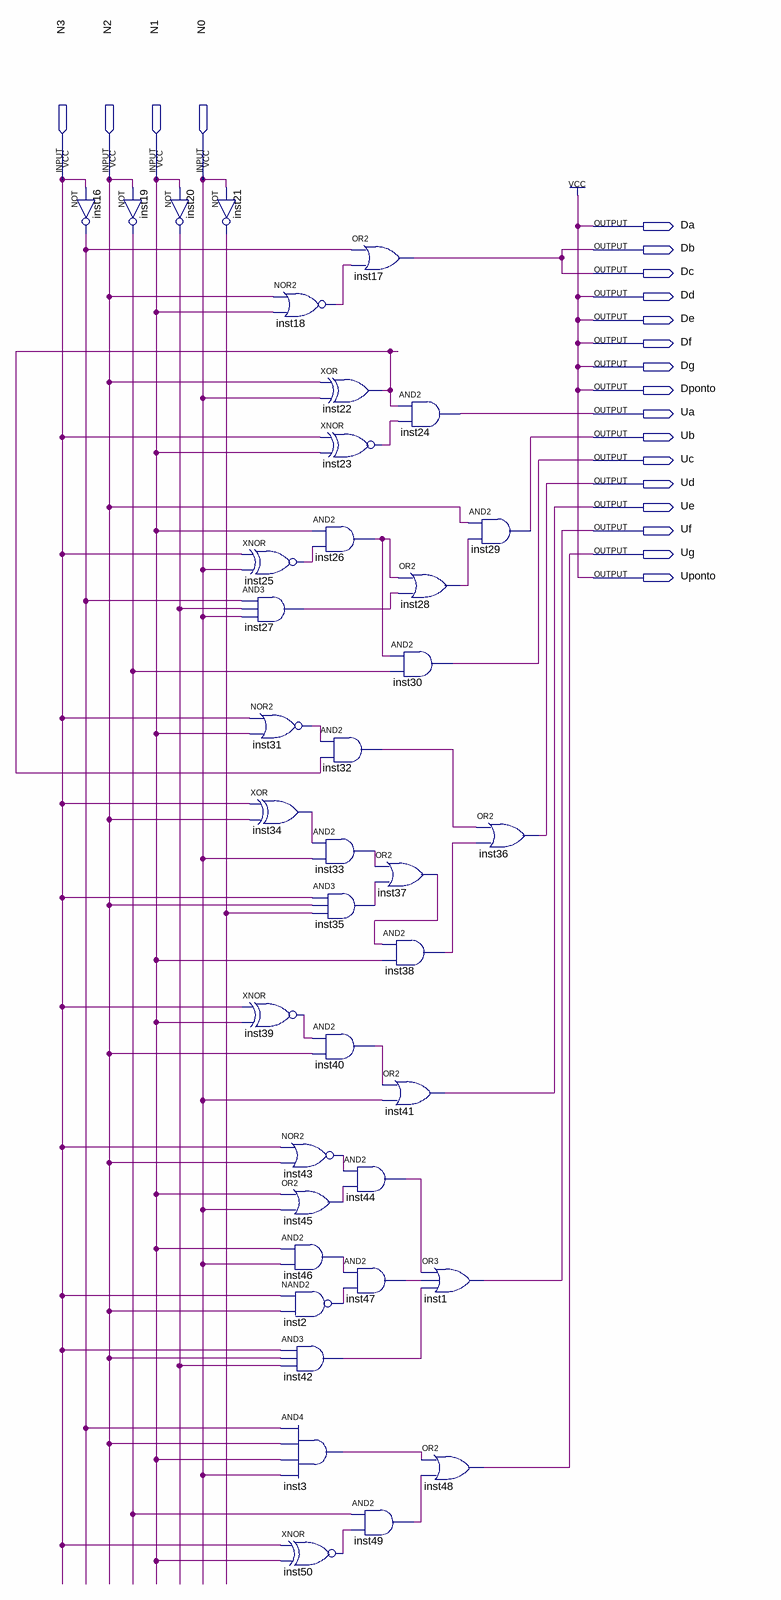
[diagram p0: schematic sheet]
// Quartus schematic decoder-7-seg-2-dig.bdf as structural Verilog: 38 symbols, 20 pins
module \decoder-7-seg-2-dig  (
  input  N3,
  input  N2,
  input  N1,
  input  N0,
  output Da,
  output Db,
  output Dc,
  output Dd,
  output De,
  output Df,
  output Dg,
  output Dponto,
  output Ua,
  output Ub,
  output Uc,
  output Ud,
  output Ue,
  output Uf,
  output Ug,
  output Uponto
);

  wire inst2_out, inst3_out, inst16_out, inst18_out, inst19_out, inst20_out, inst21_out, inst22_out,
       inst23_out, inst25_out, inst26_out, inst27_out, inst28_out, inst31_out, inst32_out, inst33_out,
       inst34_out, inst35_out, inst37_out, inst38_out, inst39_out, inst40_out, inst42_out, inst43_out,
       inst44_out, inst45_out, inst46_out, inst47_out, inst49_out, inst50_out;

  not inst16 (inst16_out, N3);
  not inst19 (inst19_out, N2);
  not inst20 (inst20_out, N1);
  not inst21 (inst21_out, N0);
  xnor inst25 (inst25_out, N3, N0);
  and inst27 (inst27_out, inst16_out, inst20_out, N0);
  nor inst31 (inst31_out, N3, N1);
  xor inst34 (inst34_out, N3, N2);
  xnor inst39 (inst39_out, N3, N1);
  nor inst18 (inst18_out, N2, N1);
  xor inst22 (inst22_out, N2, N0);
  xnor inst23 (inst23_out, N3, N1);
  and inst26 (inst26_out, N1, inst25_out);
  and inst32 (inst32_out, inst31_out, inst22_out);
  and inst33 (inst33_out, inst34_out, N0);
  and inst35 (inst35_out, N3, N2, inst21_out);
  and inst40 (inst40_out, inst39_out, N2);
  nor inst43 (inst43_out, N3, N2);
  or inst45 (inst45_out, N1, N0);
  and inst46 (inst46_out, N1, N0);
  nand inst2 (inst2_out, N3, N2);
  and inst42 (inst42_out, N3, N2, inst20_out);
  and inst3 (inst3_out, inst16_out, N2, N1, N0);
  xnor inst50 (inst50_out, N3, N1);
  or inst17 (Db, inst16_out, inst18_out);
  or inst37 (inst37_out, inst33_out, inst35_out);
  and inst38 (inst38_out, inst37_out, N1);
  or inst41 (Ue, inst40_out, N0);
  and inst44 (inst44_out, inst43_out, inst45_out);
  and inst47 (inst47_out, inst46_out, inst2_out);
  and inst49 (inst49_out, inst19_out, inst50_out);
  and inst24 (Ua, inst22_out, inst23_out);
  or inst28 (inst28_out, inst26_out, inst27_out);
  and inst30 (Uc, inst26_out, inst19_out);
  or inst1 (Uf, inst44_out, inst47_out, inst42_out);
  or inst48 (Ug, inst3_out, inst49_out);
  and inst29 (Ub, N2, inst28_out);
  or inst36 (Ud, inst32_out, inst38_out);

  assign Da = 1'b1;
  assign Dc = Db;
  assign Dd = 1'b1;
  assign De = 1'b1;
  assign Df = 1'b1;
  assign Dg = 1'b1;
  assign Dponto = 1'b1;
  assign Uponto = 1'b1;
endmodule
